# Altium project Grabber.PrjPCB (part 2 of 2)

## Sheet EEM_Connectors.SchDoc: =DocumentName
size A4; SPICEModelCacheVGBTAUBO: <root> / <DocumentId>VGBTAUBO</DocumentId> / </root>; DocumentNumber: 1; Revision: 0; SheetNumber: 6; SheetTotal: 10; Version: 2.0.0; Author 1: Grzegorz Kasprowicz; Author 2: Maciej Przybysz, Marta Fąfara; Author 3: Krzysztof Belewicz; Github: https://github.com/sinara-hw/Grabber; Last modified by: Krzysztof Belewicz
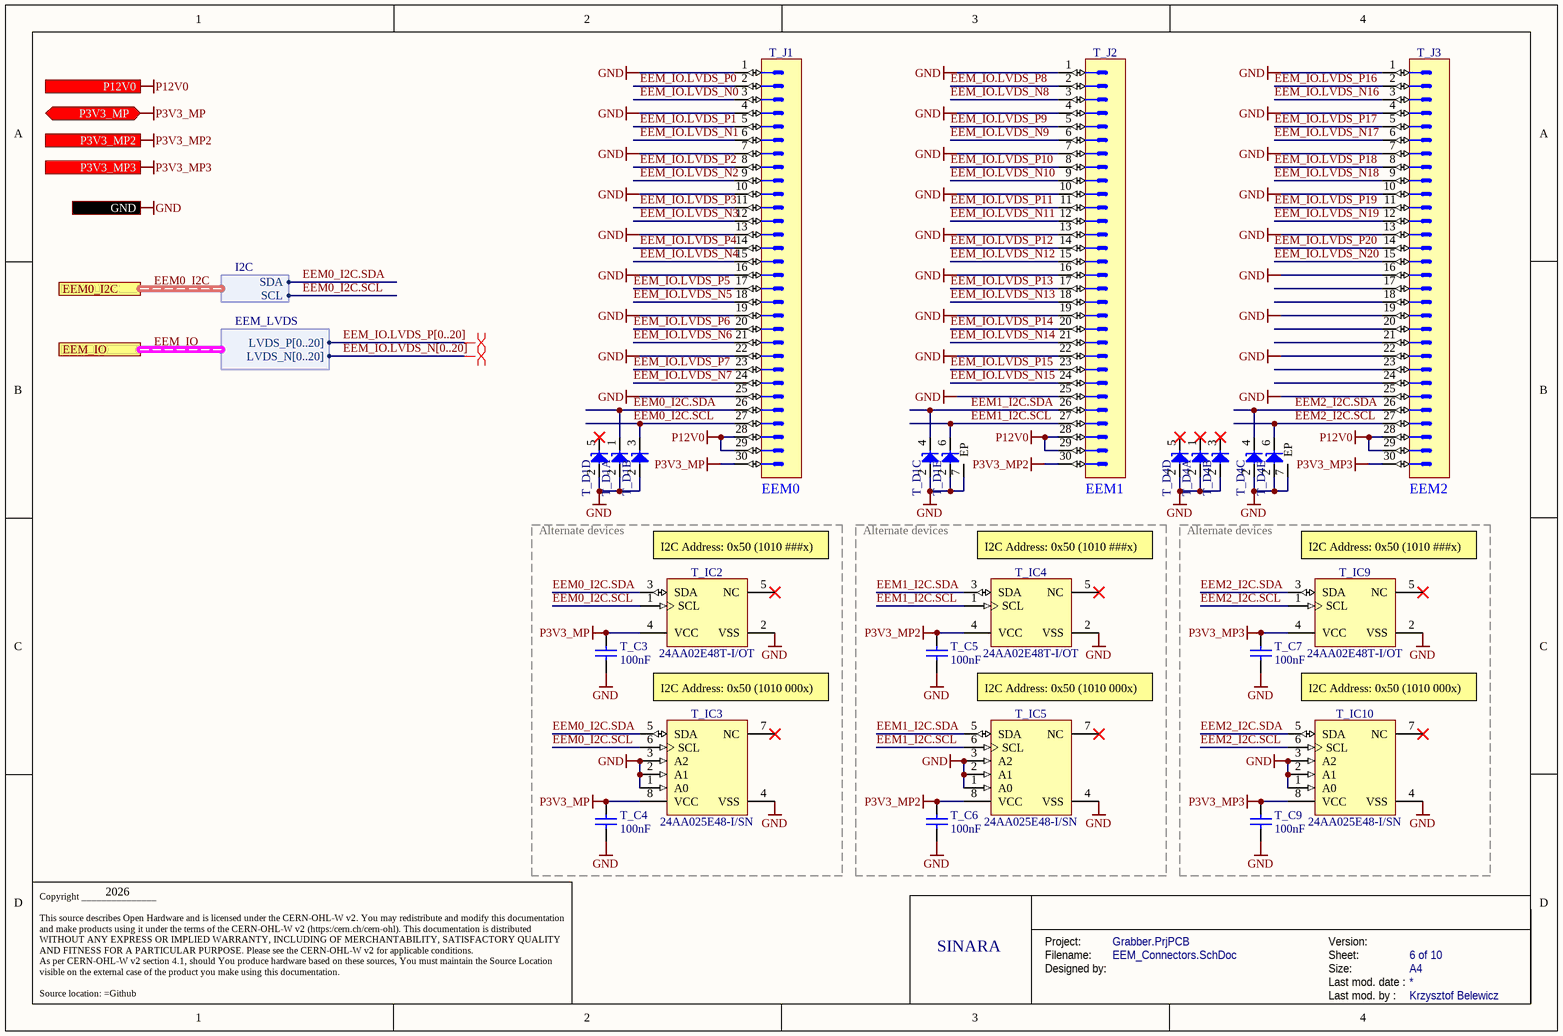
[diagram p4: EEM_Connectors.SchDoc]

### Parts
(Parts that share a designator on the sheet are numbered #1, #2 ... from top to bottom, then left to right.)
T_C3  100nF  [CAPC1005X55N]
T_C4  100nF  [CAPC1005X55N]
T_C5  100nF  [CAPC1005X55N]
T_C6  100nF  [CAPC1005X55N]
T_C7  100nF  [CAPC1005X55N]
T_C9  100nF  [CAPC1005X55N]
T_D1  UCLAMP3305P.TCT  [SON50P160X65_HS-7N]  (value not drawn)  (parts A,B,C,D,E of 5)
T_D4#2  UCLAMP3305P.TCT  [SON50P160X65_HS-7N]  (value not drawn)  (parts A,B,C,D,E of 5)
T_IC2  24AA02E48T-I/OT  [SOT95P280X145-5N]
T_IC3  24AA025E48-I/SN  [SOIC127P600X175-8N]
T_IC4  24AA02E48T-I/OT  [SOT95P280X145-5N]
T_IC5  24AA025E48-I/SN  [SOIC127P600X175-8N]
T_IC9  24AA02E48T-I/OT  [SOT95P280X145-5N]
T_IC10  24AA025E48-I/SN  [SOIC127P600X175-8N]
T_J1  (no value)  [3M_N2530-6002RB]
T_J2  (no value)  [3M_N2530-6002RB]
T_J3  (no value)  [3M_N2530-6002RB]

### Blocks framed on the sheet
Alternate devices: T_C3 T_C4 T_IC2 T_IC3
Alternate devices: T_C5 T_C6 T_IC4 T_IC5
Alternate devices: T_C7 T_C9 T_IC9 T_IC10

### Ports
EEM0_I2C (harness I2C), EEM_IO (harness EEM_LVDS), GND, P3V3_MP2 (out), P3V3_MP3 (out), P3V3_MP (bidir), P12V0 (out)

### Harnesses
EEM_LVDS: LVDS_P[0..20], LVDS_N[0..20]
I2C: SDA, SCL

### Nets
GND: T_C3.1 T_C4.1 T_C5.1 T_C6.1 T_C7.1 T_C9.1 T_D1.2(A) T_D1.7(EP) T_D4#2.2(A) T_D4#2.7(EP) T_IC2.2(VSS) T_IC3.1(A0) T_IC3.2(A1) T_IC3.3(A2) T_IC3.4(VSS) T_IC4.2(VSS) T_IC5.1(A0) T_IC5.2(A1) T_IC5.3(A2) T_IC5.4(VSS) T_IC9.2(VSS) T_IC10.1(A0) T_IC10.2(A1) T_IC10.3(A2) T_IC10.4(VSS) T_J1.1 T_J1.4 T_J1.7 T_J1.10 T_J1.13 T_J1.16 T_J1.19 T_J1.22 T_J1.25 T_J2.1 T_J2.4 T_J2.7 T_J2.10 T_J2.13 T_J2.16 T_J2.19 T_J2.22 T_J2.25 T_J3.1 T_J3.4 T_J3.7 T_J3.10 T_J3.13 T_J3.16 T_J3.19 T_J3.22 T_J3.25 ; port GND
P3V3_MP: T_C3.2 T_C4.2 T_IC2.4(VCC) T_IC3.8(VCC) T_J1.30 ; port P3V3_MP
P3V3_MP2: T_C5.2 T_C6.2 T_IC4.4(VCC) T_IC5.8(VCC) T_J2.30 ; port P3V3_MP2
P3V3_MP3: T_C7.2 T_C9.2 T_IC9.4(VCC) T_IC10.8(VCC) T_J3.30 ; port P3V3_MP3
P12V0: T_J1.28 T_J1.29 T_J2.28 T_J2.29 T_J3.28 T_J3.29 ; port P12V0
EEM0_I2C.SCL: T_D1.3(C) T_IC2.1(SCL) T_IC3.6(SCL) T_J1.27 ; port EEM0_I2C.SCL
EEM0_I2C.SDA: T_D1.1(C) T_IC2.3(SDA) T_IC3.5(SDA) T_J1.26 ; port EEM0_I2C.SDA
EEM1_I2C.SCL: T_D1.6(C) T_IC4.1(SCL) T_IC5.6(SCL) T_J2.27
EEM1_I2C.SDA: T_D1.4(C) T_IC4.3(SDA) T_IC5.5(SDA) T_J2.26
EEM2_I2C.SCL: T_D4#2.6(C) T_IC9.1(SCL) T_IC10.6(SCL) T_J3.27
EEM2_I2C.SDA: T_D4#2.4(C) T_IC9.3(SDA) T_IC10.5(SDA) T_J3.26
EEM_IO.LVDS_N0: T_J1.3
EEM_IO.LVDS_N1: T_J1.6
EEM_IO.LVDS_N2: T_J1.9
EEM_IO.LVDS_N3: T_J1.12
EEM_IO.LVDS_N4: T_J1.15
EEM_IO.LVDS_N5: T_J1.18
EEM_IO.LVDS_N6: T_J1.21
EEM_IO.LVDS_N7: T_J1.24
EEM_IO.LVDS_N8: T_J2.3
EEM_IO.LVDS_N9: T_J2.6
EEM_IO.LVDS_N10: T_J2.9
EEM_IO.LVDS_N11: T_J2.12
EEM_IO.LVDS_N12: T_J2.15
EEM_IO.LVDS_N13: T_J2.18
EEM_IO.LVDS_N14: T_J2.21
EEM_IO.LVDS_N15: T_J2.24
EEM_IO.LVDS_N16: T_J3.3
EEM_IO.LVDS_N17: T_J3.6
EEM_IO.LVDS_N18: T_J3.9
EEM_IO.LVDS_N19: T_J3.12
EEM_IO.LVDS_N20: T_J3.15
EEM_IO.LVDS_P0: T_J1.2
EEM_IO.LVDS_P1: T_J1.5
EEM_IO.LVDS_P2: T_J1.8
EEM_IO.LVDS_P3: T_J1.11
EEM_IO.LVDS_P4: T_J1.14
EEM_IO.LVDS_P5: T_J1.17
EEM_IO.LVDS_P6: T_J1.20
EEM_IO.LVDS_P7: T_J1.23
EEM_IO.LVDS_P8: T_J2.2
EEM_IO.LVDS_P9: T_J2.5
EEM_IO.LVDS_P10: T_J2.8
EEM_IO.LVDS_P11: T_J2.11
EEM_IO.LVDS_P12: T_J2.14
EEM_IO.LVDS_P13: T_J2.17
EEM_IO.LVDS_P14: T_J2.20
EEM_IO.LVDS_P15: T_J2.23
EEM_IO.LVDS_P16: T_J3.2
EEM_IO.LVDS_P17: T_J3.5
EEM_IO.LVDS_P18: T_J3.8
EEM_IO.LVDS_P19: T_J3.11
EEM_IO.LVDS_P20: T_J3.14

Not connected (* = marked no-connect by the designer): T_D1 5(C)*; T_D4#2 1(C)* 3(C)* 5(C)*; T_IC2 5(NC)*; T_IC3 7(NC)*; T_IC4 5(NC)*; T_IC5 7(NC)*; T_IC9 5(NC)*; T_IC10 7(NC)*; T_J3 17 18 20 21 23 24

### Buses and harness runs
bus EEM_IO.LVDS_N[0..20]
bus EEM_IO.LVDS_P[0..20]
harness EEM0_I2C = port EEM0_I2C
harness EEM_IO = port EEM_IO

### Layout directives
differential pair; differential pair class Diff_100Ohm: (no net found under the mark)

### Notes on the sheet
- (near T_J1) EEM0
- (near T_J2) EEM1
- (near T_J3) EEM2
- (near T_IC2) I2C Address: 0x50 (1010 ###x)
- (near T_IC4) I2C Address: 0x50 (1010 ###x)
- (near T_IC9) I2C Address: 0x50 (1010 ###x)
- I2C Address: 0x50 (1010 000x)
- 2026
- SINARA
- Project:
- Designed by:
- Filename:
- Size:
- Version:
- Last mod. date :
- Sheet:
- A4
- Copyright _______________
  This source describes Open Hardware and is licensed under the CERN-OHL-W v2. You may redistribute and modify this documentation and make products using it under the terms of the CERN-OHL-W v2 (https:/cern.ch/cern-ohl). This documentation is distributed WITHOUT ANY EXPRESS OR IMPLIED WARRANTY, INCLUDING OF MERCHANTABILITY, SATISFACTORY QUALITY AND FITNESS FOR A PARTICULAR PURPOSE. Please see the CERN-OHL-W v2 for applicable conditions.
  As per CERN-OHL-W v2 section 4.1, should You produce hardware based on these sources, You must maintain the Source Location visible on the external case of the product you make using this documentation.
  Source location: =Github
- Last mod. by :

### Library data of the parts
T_C3-T_C7 T_C9 = CC0402_100NF_50V_10%_X7R: as C59 on sheet Power_Supplies; Part Number: CC0402_100NF_50V_10%_X7R; Component Kind: Standard; Component Type: Standard; Pin Count: 2; Value: 100nF; Status: None; Manufacturer Part Number: CC0402_100NF_50V_10%_X7R; Case: 0402; Mounted: Yes; Socket: No; SMD: Yes; Sense: No; HelpURL: \\cern.ch\dfs\Applications\Altium\Datasheets\CC0402_MURATA_GRM155R71H104KE14D.pdf; Author: CERN DEM MR; CreateDate: 30.06.2017; LatestRevisionDate: 30.06.2017; Manufacturer1 Example: MURATA; Manufacturer1 ComponentHeight: 0.55mm
T_D1 T_D4#2 = CMP-004-00037-2: Diode TVS Quint Common Anode Uni-Dir 3.3V 40W 6-Pin SLP EP T/R; Max Operating Temperature: 125°C; Min Operating Temperature: -55°C; Pins: 6; Mounting Technology: Surface Mount
T_IC2 T_IC4 T_IC9 = 24AA02E48T-I/OT: 1.7V-5.5V, 2K I2C Serial EEPROM With EUI-48 Node Identity; Manufacturer: MICROCHIP TECHNOLOGY; PressFit: No; Bonding: No; Part Number: 24AA02E48T-I/OT; Component Kind: Standard; Component Type: Standard; Device: 24AA02E48T-I/OT; PackageDescription: SOT, 0.95mm pitch; 5 pin, 1.60mm W X 2.90mm L X 1.45mm H body, IPC Medium Density; Part Description: 1.7V-5.5V, 2K I2C Serial EEPROM with EUI-48 Node Identity; Manufacturer Part Number: 24AA02E48T-I/OT; Pin Count: 5; Case: SOT23-5; Mounted: Yes; Socket: No; SMD: Yes; Sense: No; ComponentHeight: 1.45mm; HelpURL: \\cern.ch\dfs\Applications\Altium\Datasheets\24AA02E48T-I-OT.pdf; Author: CERN DEM MR; CreateDate: 31.03.2016; LatestRevisionDate: 31.03.2016
T_IC3 T_IC5 T_IC10 = 24AA025E48-I/SN: 1.7V-5.5V, 2K I2C™ Serial EEPROMs with EUI-48™ Node Identity; Manufacturer: MICROCHIP TECHNOLOGY; PressFit: No; Bonding: No; Part Number: 24AA025E48-I/SN; Component Kind: Standard; Component Type: Standard; Device: 24AA025E48-I/SN; PackageDescription: SOIC 8, Pitch 1.27mm - Body 4x5mm, IPC Medium Density; Part Description: 1.7V-5.5V, 2K I2C™ Serial EEPROMs with EUI-48™ Node Identity; Manufacturer Part Number: 24AA025E48-I/SN; Pin Count: 8; Case: SOIC8; Mounted: Yes; Socket: No; SMD: Yes; Sense: No; ComponentHeight: 1.75mm; HelpURL: \\cern.ch\dfs\Applications\Altium\Datasheets\24AA025E48-I-SN.pdf; Author: CERN DEM MR; CreateDate: 19.07.2016; LatestRevisionDate: 19.07.2016
T_J1-T_J3 = 3M_N2530-6002RB: Connector 30 Male; Part Description: 30 Contacts - Straight .100'' x .100'' Low Profile Four-Wall Header, 2500 Series; Manufacturer: 3M; PressFit: No; Part Number: 3M_N2530-6002RB; Component Kind: Standard; Component Type: Standard; Pin Count: 30; Family: Header 30; Mounted: Yes; Socket: No; SMD: No; Sense: No; Status: None; Manufacturer Part Number: N2530-6002RB; ComponentHeight: 10.03mm; HelpURL: \\cern.ch\dfs\Applications\Altium\Datasheets\3M_N2530-6002RB.pdf; Author: CERN DEM JLC; CreateDate: 11.02.2009; LatestRevisionDate: 11.08.2009

## Sheet Temperature_monitoring.SchDoc: =DocumentName
size A4; DocumentNumber: 1; Revision: 0; SheetNumber: 9; SheetTotal: 10; Version: 2.0.0; Author 1: Grzegorz Kasprowicz; Author 2: Maciej Przybysz, Marta Fąfara; Author 3: Krzysztof Belewicz; Github: https://github.com/sinara-hw/Grabber; Last modified by: Krzysztof Belewicz
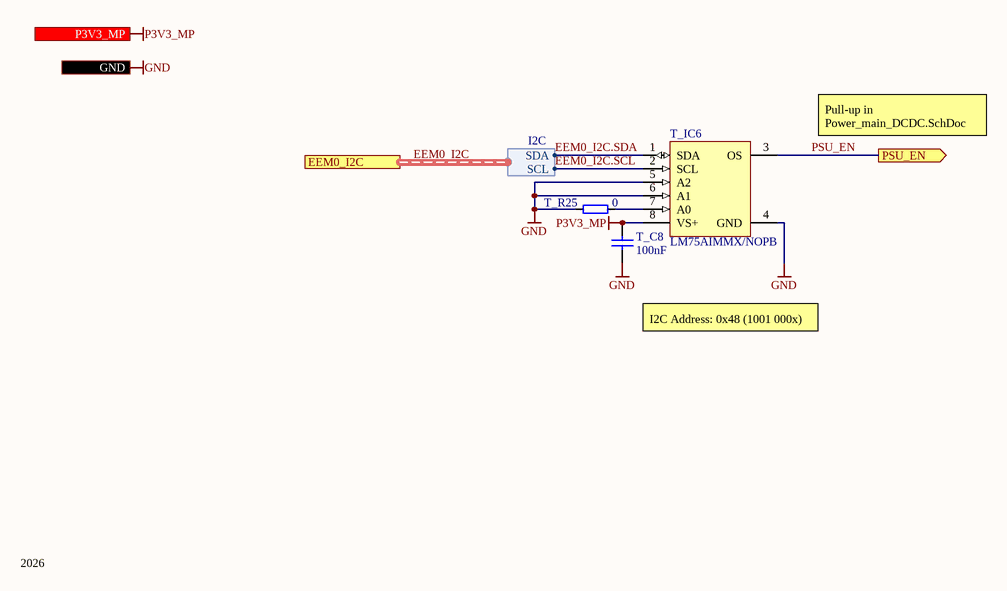
[diagram p5: Temperature_monitoring.SchDoc]

### Parts
T_C8  100nF  [CAPC1005X55N]
T_IC6  LM75AIMMX/NOPB  [DGK0008A_M]
T_R25  0  [RESC1005X40N]

### Ports
EEM0_I2C (harness I2C), GND, P3V3_MP (in), PSU_EN (out)

### Harnesses
I2C: SDA, SCL

### Nets
GND: T_C8.1 T_IC6.4(GND) T_IC6.5(A2) T_IC6.6(A1) T_R25.1 ; port GND
P3V3_MP: T_C8.2 T_IC6.8(VS+) ; port P3V3_MP
EEM0_I2C.SCL: T_IC6.2(SCL) ; port EEM0_I2C.SCL
EEM0_I2C.SDA: T_IC6.1(SDA) ; port EEM0_I2C.SDA
PSU_EN: T_IC6.3(OS) ; port PSU_EN
NetT_IC6_7: T_IC6.7(A0) T_R25.2

### Buses and harness runs
harness EEM0_I2C = port EEM0_I2C

### Notes on the sheet
- Pull-up in Power_main_DCDC.SchDoc
- I2C Address: 0x48 (1001 000x)
- 2026
- SINARA
- Project:
- Designed by:
- Filename:
- Size:
- Version:
- Last mod. date :
- Sheet:
- A4
- Copyright _______________
  This source describes Open Hardware and is licensed under the CERN-OHL-W v2. You may redistribute and modify this documentation and make products using it under the terms of the CERN-OHL-W v2 (https:/cern.ch/cern-ohl). This documentation is distributed WITHOUT ANY EXPRESS OR IMPLIED WARRANTY, INCLUDING OF MERCHANTABILITY, SATISFACTORY QUALITY AND FITNESS FOR A PARTICULAR PURPOSE. Please see the CERN-OHL-W v2 for applicable conditions.
  As per CERN-OHL-W v2 section 4.1, should You produce hardware based on these sources, You must maintain the Source Location visible on the external case of the product you make using this documentation.
  Source location: =Github
- Last mod. by :

### Library data of the parts
T_C8 = CC0402_100NF_50V_10%_X7R: as C59 on sheet Power_Supplies; Part Number: CC0402_100NF_50V_10%_X7R; Component Kind: Standard; Component Type: Standard; Pin Count: 2; Value: 100nF; Status: None; Manufacturer Part Number: CC0402_100NF_50V_10%_X7R; Case: 0402; Mounted: Yes; Socket: No; SMD: Yes; Sense: No; Manufacturer1 Example: MURATA; Manufacturer1 ComponentHeight: 0.55mm; HelpURL: \\cern.ch\dfs\Applications\Altium\Datasheets\CC0402_MURATA_GRM155R71H104KE14D.pdf; Author: CERN DEM MR; CreateDate: 30.06.2017; LatestRevisionDate: 30.06.2017
T_IC6 = CMP-010-00652-2: Serial Switch/Digital Sensor, 9 Bit(s), 3Cel, Square, 8 Pin, Surface Mount; Min Supply Voltage: 2.7V; Max Supply Voltage: 5.5V; Sensor Type: TEMPERATURE SENSOR,SWITCH/DIGITAL OUTPUT,SERIAL; Max Operating Temperature: 125°C; Min Operating Temperature: -55°C; Pins: 8; RoHS Compliant: Yes; Mounting Technology: Surface Mount
T_R25 = R0402_0R_JUMPER: Resistor; Part Description: 1A (0.05R Max DC Resistance) Zero Ohm Jumper; Manufacturer: GENERIC; Manufacturer1 Part Number: 232270591001L; Part Number: R0402_0R_JUMPER; Component Kind: Standard; Component Type: Standard; Pin Count: 2; Value: 0; Status: Not recommended; Manufacturer Part Number: R0402_0R_JUMPER; Case: 0402; Mounted: Yes; Sense: No; Socket: No; SMD: Yes; Manufacturer1 Example: YAGEO PHYCOMP; Manufacturer1 ComponentHeight: 0.4mm; HelpURL: \\cern.ch\dfs\Applications\Altium\Datasheets\R0402_Phycomp_RC0402.pdf; Author: CERN DEM JLC; CreateDate: 03.12.2007; LatestRevisionDate: 17.10.2012

## Sheet Mechanical.SchDoc: =DocumentName
size A4; DocumentNumber: 1; Revision: 0; SheetNumber: 10; SheetTotal: 10; Version: 2.0.0; Author 1: Grzegorz Kasprowicz; Author 2: Maciej Przybysz, Marta Fąfara; Author 3: Krzysztof Belewicz; Github: https://github.com/sinara-hw/Grabber; Last modified by: Krzysztof Belewicz
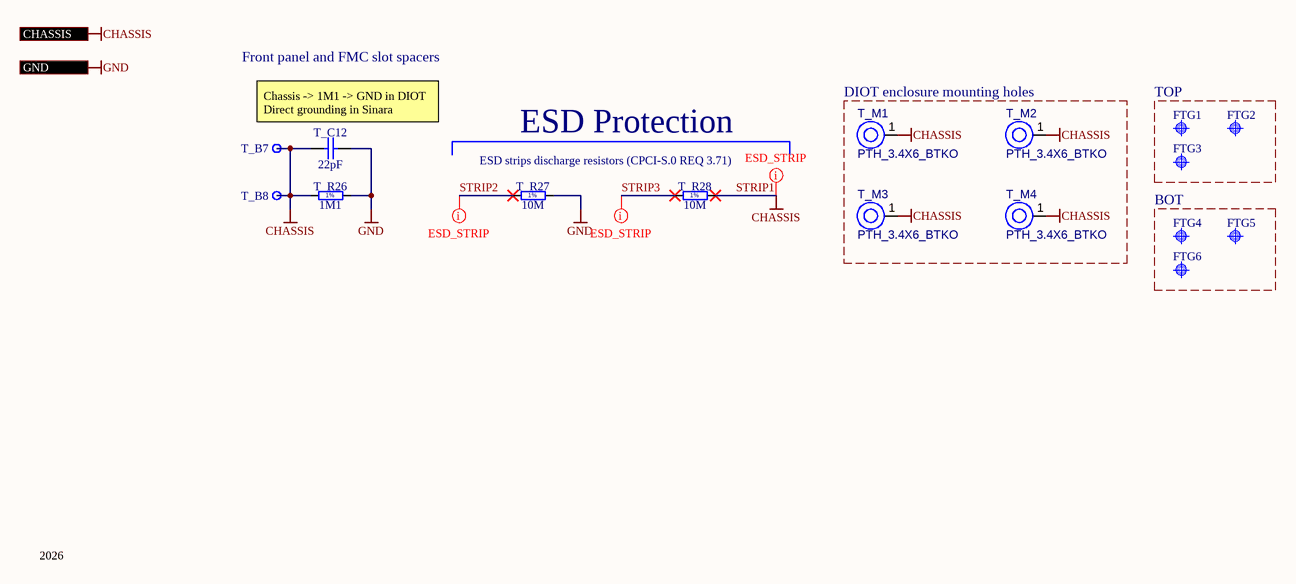
[diagram p6: Mechanical.SchDoc]

### Parts
FTG1  Use only in PCB  [FIDUCIAL_TOP_C100-200]  (value not drawn)  (no BOM)
FTG2  Use only in PCB  [FIDUCIAL_TOP_S100-200]  (value not drawn)  (no BOM)
FTG3  Use only in PCB  [FIDUCIAL_TOP_S100-200]  (value not drawn)  (no BOM)
FTG4  Use only in PCB  [FIDUCIAL_TOP_C100-200]  (value not drawn)  (no BOM)
FTG5  Use only in PCB  [FIDUCIAL_TOP_S100-200]  (value not drawn)  (no BOM)
FTG6  Use only in PCB  [FIDUCIAL_TOP_S100-200]  (value not drawn)  (no BOM)
T_B7  Plated Hole  [c600h270]  (value not drawn)  (no BOM)
T_B8  Plated Hole  [c600h270]  (value not drawn)  (no BOM)
T_C12  22pF  [CAPC1005X55N]
T_M1  PTH_3.4X6_BTKO  [PTH-M3.4x6.0_BTKO]  (no BOM)
T_M2  PTH_3.4X6_BTKO  [PTH-M3.4x6.0_BTKO]  (no BOM)
T_M3  PTH_3.4X6_BTKO  [PTH-M3.4x6.0_BTKO]  (no BOM)
T_M4  PTH_3.4X6_BTKO  [PTH-M3.4x6.0_BTKO]  (no BOM)
T_R26  1M1  [RESC2012X60N]
T_R27  10M  [RESC2113X55N]
T_R28  10M  [RESC2113X55N]

### Blocks framed on the sheet
DIOT enclosure mounting holes: T_M1-T_M4
TOP: FTG1-FTG3
BOT: FTG4-FTG6

### Ports
CHASSIS, GND

### Nets
GND: T_C12.2 T_R26.2 T_R27.2 ; port GND
STRIP1: T_B7.1 T_B8.1 T_C12.1 T_M1.1(H1) T_M2.1(H1) T_M3.1(H1) T_M4.1(H1) T_R26.1 T_R28.2 ; port CHASSIS  [also labelled CHASSIS]
STRIP2: T_R27.1
STRIP3: T_R28.1

### Layout directives
net class ESD_STRIP: STRIP1, STRIP2, STRIP3

### Notes on the sheet
- Front panel and FMC slot spacers
- Chassis -> 1M1 -> GND in DIOT
  Direct grounding in Sinara
- ESD strips discharge resistors (CPCI-S.0 REQ 3.71)
- ESD Protection
- 2026
- SINARA
- Project:
- Designed by:
- Filename:
- Size:
- Version:
- Last mod. date :
- Sheet:
- A4
- Copyright _______________
  This source describes Open Hardware and is licensed under the CERN-OHL-W v2. You may redistribute and modify this documentation and make products using it under the terms of the CERN-OHL-W v2 (https:/cern.ch/cern-ohl). This documentation is distributed WITHOUT ANY EXPRESS OR IMPLIED WARRANTY, INCLUDING OF MERCHANTABILITY, SATISFACTORY QUALITY AND FITNESS FOR A PARTICULAR PURPOSE. Please see the CERN-OHL-W v2 for applicable conditions.
  As per CERN-OHL-W v2 section 4.1, should You produce hardware based on these sources, You must maintain the Source Location visible on the external case of the product you make using this documentation.
  Source location: =Github
- Last mod. by :
- (in symbol R0805_1M1_1%_0.125W_100PPM) 1%
- (in symbol R0805_10M_1%_0.125W_100PPM_VISHAY_CRCW e3) 1%

### Library data of the parts
FTG1 FTG4 = FIDUCIAL_TARGET_C100-200: Fiducial Target; Part Description: Round Fiducial Target, Top Layer, 1.0mm, Top Solder 2.0mm, Keepout =2.0mm; Mounted: No; Part Number: FIDUCIAL_TARGET_C100-200; Component Type: Standard (No BOM); Pin Count: 1; Family: Fiducial; Socket: No; SMD: Yes; Sense: No; Status: None; ComponentHeight: 0mm; HelpURL: Undefined; Author: CERN DEM JLC; CreateDate: 09.02.2010; LatestRevisionDate: 04.04.2012; PackageDescription: Round Fiducial Target, Top Layer, 1.0mm, Top Solder 2.0mm, Keepout =2.0mm
FTG2 FTG3 FTG5 FTG6 = FIDUCIAL_TARGET_S100-200: Fiducial Target; Part Description: Square Fiducial Target, Top Layer, 1.0mm, Top Solder 2.0mm, Keepout =2.0mm; Mounted: No; Part Number: FIDUCIAL_TARGET_S100-200; Component Type: Standard (No BOM); Pin Count: 1; Family: Fiducial; Socket: No; SMD: Yes; Sense: No; Status: None; ComponentHeight: 0mm; HelpURL: Undefined; Author: CERN DEM JLC; CreateDate: 09.02.2010; LatestRevisionDate: 04.04.2012; PackageDescription: Square Fiducial Target, Top Layer, 1.0mm, Top Solder 2.0mm, Keepout =2.0mm
T_B7 T_B8 = PLATED_HOLE2.7_PAD6.0: Single Terminal Socket; Part Description: Plated Through Hole: Hole Dia.=2.7mm Pad Dia.=6.0mm; Mounted: No; Part Number: PLATED_HOLE2.7_PAD6.0; Component Type: Standard (No BOM); Pin Count: 1; Family: Plated Hole; Socket: No; SMD: No; Sense: No; Status: None; ComponentHeight: 0mm; HelpURL: Undefined; Author: CERN DEM HF; CreateDate: 28.08.2024; LatestRevisionDate: 28.08.2024; PackageDescription: Plated Through Hole: Hole Dia.=2.7mm Pad Dia.=6.0mm
T_C12 = CC0402_22PF_50V_5%_C0G: Non-polarised capacitor; Part Description: SMD Multilayer Chip Ceramic Capacitor; Manufacturer: GENERIC; Manufacturer1 Part Number: C0402C220J5GACTU; Voltage: 50V; TC: C0G/NP0; Tolerance: ±5%; Part Number: CC0402_22PF_50V_5%_C0G; Component Kind: Standard; Component Type: Standard; Pin Count: 2; Value: 22pF; Status: Preferred; Manufacturer Part Number: CC0402_22PF_50V_5%_C0G; Case: 0402; Mounted: Yes; Socket: No; SMD: Yes; Manufacturer1 Example: KEMET; Manufacturer1 ComponentHeight: 0.55mm; HelpURL: \\cern.ch\dfs\Applications\Altium\Datasheets\CC0402_C0G_KEMET_(Commercial Grade).pdf; Author: CERN DEM JLC; CreateDate: 2007-12-03; LatestRevisionDate: 2007-12-03; Sense: No
T_M1-T_M4 = CMP-00028-00019-2: PTH  Hole 3.4, 6mm pad; Pins: 1
T_R26 = R0805_1M1_1%_0.125W_100PPM: Resistor - 1%; Part Description: General Purpose Thick Film Chip Resistor; Manufacturer: GENERIC; Manufacturer1 Part Number: NRC10F1104TRF; PressFit: No; Part Number: R0805_1M1_1%_0.125W_100PPM; Component Kind: Standard; Component Type: Standard; Pin Count: 2; Value: 1M1; Status: Preferred; Manufacturer Part Number: R0805_1M1_1%_0.125W_100PPM; Case: 0805; Mounted: Yes; Sense: No; Socket: No; SMD: Yes; Manufacturer1 Example: NIC COMPONENT; Manufacturer1 ComponentHeight: 0.6mm; HelpURL: \\cern.ch\dfs\Applications\Altium\Datasheets\R0805_NIC_NRC.pdf; Author: CERN DEM JLC; CreateDate: 03/12/2007; LatestRevisionDate: 13/03/2008
T_R27 T_R28 = R0805_10M_1%_0.125W_100PPM_VISHAY_CRCW e3: Resistor - 1%; Part Description: 150V, Standard Thick Film Chip Resistor; Manufacturer: VISHAY DALE; Manufacturer Part Number: CRCW080510M0FKEA; Power: 0.125W; TC: ±100ppm/°C; PressFit: No; Part Number: R0805_10M_1%_0.125W_100PPM_VISHAY_CRCW e3; Component Kind: Standard; Component Type: Standard; Pin Count: 2; Value: 10M; Status: None; Tolerance: ±1%; Case: 0805; Mounted: Yes; Sense: No; Socket: No; SMD: Yes; ComponentHeight: 0.5mm; HelpURL: \\cern.ch\dfs\Applications\Altium\Datasheets\R0805_VISHAY_CRCW e3.pdf; Author: CERN DEM BC; CreateDate: 2019-11-12; LatestRevisionDate: 2019-11-12

## Sheet FP_Connectors.SchDoc: =DocumentName
size A4; DocumentNumber: 1; Revision: 0; SheetNumber: 5; SheetTotal: 10; Version: 2.0.0; Author 1: Grzegorz Kasprowicz; Author 2: Maciej Przybysz, Marta Fąfara; Author 3: Krzysztof Belewicz; Github: https://github.com/sinara-hw/Grabber; Last modified by: Krzysztof Belewicz
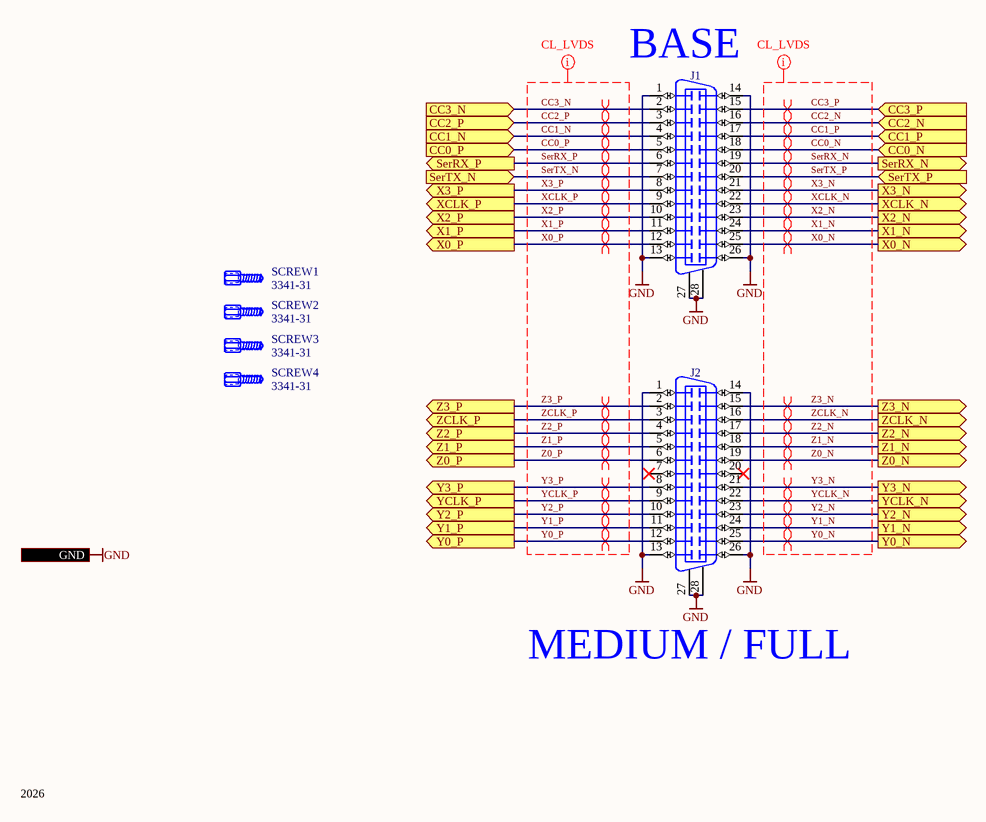
[diagram p7: FP_Connectors.SchDoc]

### Parts
J1  N10226-5212PC  [3M_N10226-5212PC]  (value not drawn)
J2  N10226-5212PC  [3M_N10226-5212PC]  (value not drawn)
SCREW1  3341-31  [3M_3341-31]
SCREW2  3341-31  [3M_3341-31]
SCREW3  3341-31  [3M_3341-31]
SCREW4  3341-31  [3M_3341-31]

### Ports
CC0_N (in), CC0_P (in), CC1_N (in), CC1_P (in), CC2_N (in), CC2_P (in), CC3_N (in), CC3_P (in), GND, SerRX_N (out), SerRX_P (out), SerTX_N (in), SerTX_P (in), X0_N (out), X0_P (out), X1_N (out), X1_P (out), X2_N (out), X2_P (out), X3_N (out), X3_P (out), XCLK_N (out), XCLK_P (out), Y0_N (out), Y0_P (out), Y1_N (out), Y1_P (out), Y2_N (out), Y2_P (out), Y3_N (out), Y3_P (out), YCLK_N (out), YCLK_P (out), Z0_N (out), Z0_P (out), Z1_N (out), Z1_P (out), Z2_N (out), Z2_P (out), Z3_N (out), Z3_P (out), ZCLK_N (out), ZCLK_P (out)

### Nets
GND: J1.1 J1.13 J1.14 J1.26 J1.27 J1.28 J2.1 J2.13 J2.14 J2.26 J2.27 J2.28 ; port GND
CC0_N: J1.18 ; port CC0_N
CC0_P: J1.5 ; port CC0_P
CC1_N: J1.4 ; port CC1_N
CC1_P: J1.17 ; port CC1_P
CC2_N: J1.16 ; port CC2_N
CC2_P: J1.3 ; port CC2_P
CC3_N: J1.2 ; port CC3_N
CC3_P: J1.15 ; port CC3_P
SerRX_N: J1.19 ; port SerRX_N
SerRX_P: J1.6 ; port SerRX_P
SerTX_N: J1.7 ; port SerTX_N
SerTX_P: J1.20 ; port SerTX_P
X0_N: J1.25 ; port X0_N
X0_P: J1.12 ; port X0_P
X1_N: J1.24 ; port X1_N
X1_P: J1.11 ; port X1_P
X2_N: J1.23 ; port X2_N
X2_P: J1.10 ; port X2_P
X3_N: J1.21 ; port X3_N
X3_P: J1.8 ; port X3_P
XCLK_N: J1.22 ; port XCLK_N
XCLK_P: J1.9 ; port XCLK_P
Y0_N: J2.25 ; port Y0_N
Y0_P: J2.12 ; port Y0_P
Y1_N: J2.24 ; port Y1_N
Y1_P: J2.11 ; port Y1_P
Y2_N: J2.23 ; port Y2_N
Y2_P: J2.10 ; port Y2_P
Y3_N: J2.21 ; port Y3_N
Y3_P: J2.8 ; port Y3_P
YCLK_N: J2.22 ; port YCLK_N
YCLK_P: J2.9 ; port YCLK_P
Z0_N: J2.19 ; port Z0_N
Z0_P: J2.6 ; port Z0_P
Z1_N: J2.18 ; port Z1_N
Z1_P: J2.5 ; port Z1_P
Z2_N: J2.17 ; port Z2_N
Z2_P: J2.4 ; port Z2_P
Z3_N: J2.15 ; port Z3_N
Z3_P: J2.2 ; port Z3_P
ZCLK_N: J2.16 ; port ZCLK_N
ZCLK_P: J2.3 ; port ZCLK_P

Not connected (* = marked no-connect by the designer): J2 7* 20*

### Layout directives
differential pair: CC0_N, CC0_P, CC1_N, CC1_P, CC2_N, CC2_P, CC3_N, CC3_P, SerRX_N, SerRX_P, SerTX_N, SerTX_P, X0_N, X0_P, X1_N, X1_P, X2_N, X2_P, X3_N, X3_P, XCLK_N, XCLK_P, Y0_N, Y0_P, Y1_N, Y1_P, Y2_N, Y2_P, Y3_N, Y3_P, YCLK_N, YCLK_P, Z0_N, Z0_P, Z1_N, Z1_P, Z2_N, Z2_P, Z3_N, Z3_P, ZCLK_N, ZCLK_P
net class CL_LVDS: CC0_N, CC0_P, CC1_N, CC1_P, CC2_N, CC2_P, CC3_N, CC3_P, SerRX_N, SerRX_P, SerTX_N, SerTX_P, X0_N, X0_P, X1_N, X1_P, X2_N, X2_P, X3_N, X3_P, XCLK_N, XCLK_P, Y0_N, Y0_P, Y1_N, Y1_P, Y2_N, Y2_P, Y3_N, Y3_P, YCLK_N, YCLK_P, Z0_N, Z0_P, Z1_N, Z1_P, Z2_N, Z2_P, Z3_N, Z3_P, ZCLK_N, ZCLK_P

### Notes on the sheet
- (near J1) BASE
- (near J2) MEDIUM / FULL
- 2026
- SINARA
- Project:
- Designed by:
- Filename:
- Size:
- Version:
- Last mod. date :
- Sheet:
- A4
- Copyright _______________
  This source describes Open Hardware and is licensed under the CERN-OHL-W v2. You may redistribute and modify this documentation and make products using it under the terms of the CERN-OHL-W v2 (https:/cern.ch/cern-ohl). This documentation is distributed WITHOUT ANY EXPRESS OR IMPLIED WARRANTY, INCLUDING OF MERCHANTABILITY, SATISFACTORY QUALITY AND FITNESS FOR A PARTICULAR PURPOSE. Please see the CERN-OHL-W v2 for applicable conditions.
  As per CERN-OHL-W v2 section 4.1, should You produce hardware based on these sources, You must maintain the Source Location visible on the external case of the product you make using this documentation.
  Source location: =Github
- Last mod. by :

### Library data of the parts
J1 J2 = 3M_N10226-5212PC: Connector Mini D Ribbon (MDR) 26 Female; Part Description: 26 contacts, Mini D Ribbon (MDR), .050" Boardmount Through-hole Right Angle Receptacle-Shielded, Diecast Body, 102 Series; Manufacturer: 3M; PressFit: No; Part Number: N10226-5212PC; Component Kind: Standard; Component Type: Standard; Footprint: MDR 26; Pin Count: 28; Family: MDR 26; Mounted: Yes; Socket: No; SMD: No; Sense: No; Status: None; Manufacturer Part Number: N10226-5212PC; ComponentHeight: 9.4mm; HelpURL: \\cern.ch\dfs\Applications\Altium\Datasheets\3M_N10226-5212PC.pdf; Author: CERN DEM JLC; CreateDate: 18.11.2008; LatestRevisionDate: 14.10.2009
SCREW1-SCREW4 = MECH_MDR_screw_lock: VHDCI Female Screw Lock; Part Description: MDR Female Screw Locks, Thread Size: M2.5; Manufacturer: 3M; PressFit: No; Part Number: 3341-31; Component Kind: Standard; Component Type: Mechanical; Pin Count: 0; PackageDescription: MDR Female Screw Locks, Thread Size: M2.5; Mounted: Yes; Socket: No; SMD: No; Sense: No; Status: None; Value: 3341-31; Manufacturer Part Number: 3341-31; ComponentHeight: 5.48mm; HelpURL: \\cern.ch\dfs\Applications\Altium\Datasheets\TYCO_749087-2.pdf; Author: GK; CreateDate: 10.09.2013; LatestRevisionDate: 10.09.2013

## Sheet LVDS_repeater.SchDoc: =DocumentName
size A4; DocumentNumber: 1; Revision: 0; SheetNumber: 2; SheetTotal: 10; Version: 2.0.0; Author 1: Grzegorz Kasprowicz; Author 2: Maciej Przybysz, Marta Fąfara; Author 3: Krzysztof Belewicz; Github: https://github.com/sinara-hw/Grabber; Last modified by: Krzysztof Belewicz
Used 21 times, as channels U_LVDS_repeater0, U_LVDS_repeater2, U_LVDS_repeater4, U_LVDS_repeater6, U_LVDS_repeater8, U_LVDS_repeater10, U_LVDS_repeater12, U_LVDS_repeater14, U_LVDS_repeater16, U_LVDS_repeater18, U_LVDS_repeater1, U_LVDS_repeater3, U_LVDS_repeater5, U_LVDS_repeater7, U_LVDS_repeater9, U_LVDS_repeater11, U_LVDS_repeater13, U_LVDS_repeater15, U_LVDS_repeater17, U_LVDS_repeater19, U_LVDS_repeater20. Parts and nets are listed once, with the designators drawn on the sheet.
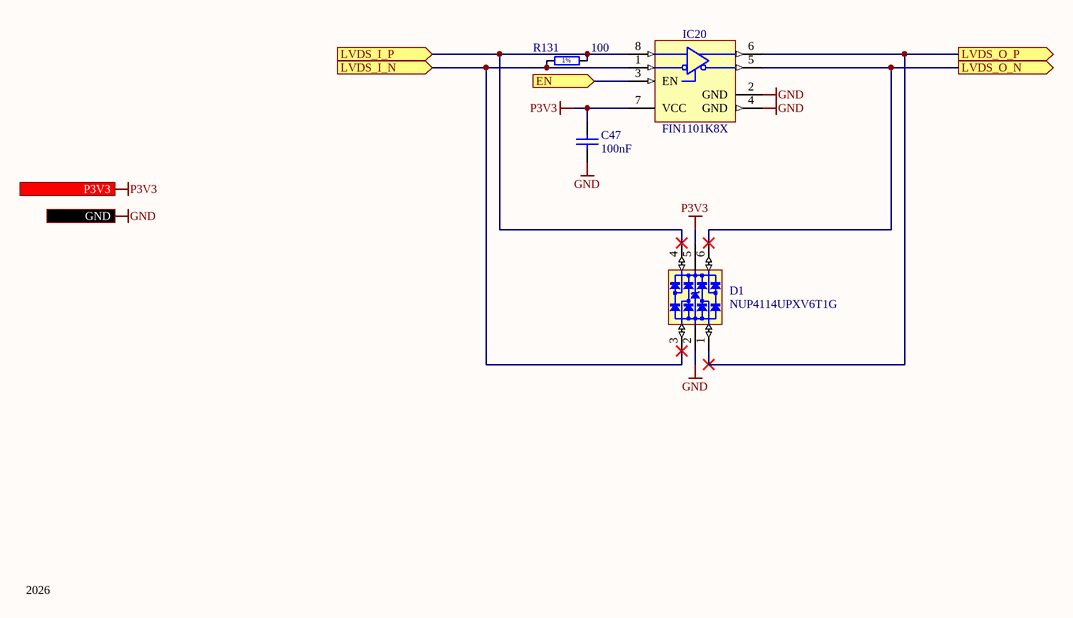
[diagram p8: LVDS_repeater.SchDoc]

### Parts
C47  100nF  [CAPC1005X55N]
D1  NUP4114UPXV6T1G  [SOTFL50P160X60-6N]
IC20  FIN1101K8X  [SOP50P310X90-8N]
R131  100  [RESC1005X40N]

### Ports
EN (in), GND, LVDS_I_N (in), LVDS_I_P (in), LVDS_O_N (out), LVDS_O_P (out), P3V3 (in)

### Nets
GND: C47.1 D1.2(GND) IC20.2(GND) IC20.4(GND) ; port GND
P3V3: C47.2 D1.5(VBUS) IC20.7(VCC) ; port P3V3
EN: IC20.3(EN) ; port EN
LVDS_I_N: D1.3(I/O2) IC20.1(RIN-) R131.1 ; port LVDS_I_N
LVDS_I_P: D1.4(I/O3) IC20.8(RIN+) R131.2 ; port LVDS_I_P
LVDS_O_N: D1.6(I/O4) IC20.5(DOUT-) ; port LVDS_O_N
LVDS_O_P: D1.1(I/O1) IC20.6(DOUT+) ; port LVDS_O_P

### Channels
U_LVDS_repeater0: designators end in A; ports EN=RX_EN GND=GND LVDS_I_N=XCLK_N LVDS_I_P=XCLK_P LVDS_O_N=EEM_IO.LVDS_N0 LVDS_O_P=EEM_IO.LVDS_P0 P3V3=P3V3
U_LVDS_repeater2: designators end in C; ports EN=RX_EN GND=GND LVDS_I_N=X0_N LVDS_I_P=X0_P LVDS_O_N=EEM_IO.LVDS_N1 LVDS_O_P=EEM_IO.LVDS_P1 P3V3=P3V3
U_LVDS_repeater4: designators end in E; ports EN=RX_EN GND=GND LVDS_I_N=X1_N LVDS_I_P=X1_P LVDS_O_N=EEM_IO.LVDS_N2 LVDS_O_P=EEM_IO.LVDS_P2 P3V3=P3V3
U_LVDS_repeater6: designators end in G; ports EN=RX_EN GND=GND LVDS_I_N=X2_N LVDS_I_P=X2_P LVDS_O_N=EEM_IO.LVDS_N3 LVDS_O_P=EEM_IO.LVDS_P3 P3V3=P3V3
U_LVDS_repeater8: designators end in I; ports EN=RX_EN GND=GND LVDS_I_N=X3_N LVDS_I_P=X3_P LVDS_O_N=EEM_IO.LVDS_N4 LVDS_O_P=EEM_IO.LVDS_P4 P3V3=P3V3
U_LVDS_repeater10: designators end in K; ports EN=RX_EN GND=GND LVDS_I_N=YCLK_N LVDS_I_P=YCLK_P LVDS_O_N=EEM_IO.LVDS_N8 LVDS_O_P=EEM_IO.LVDS_P8 P3V3=P3V3
U_LVDS_repeater12: designators end in M; ports EN=RX_EN GND=GND LVDS_I_N=Y0_N LVDS_I_P=Y0_P LVDS_O_N=EEM_IO.LVDS_N9 LVDS_O_P=EEM_IO.LVDS_P9 P3V3=P3V3
U_LVDS_repeater14: designators end in O; ports EN=RX_EN GND=GND LVDS_I_N=Y1_N LVDS_I_P=Y1_P LVDS_O_N=EEM_IO.LVDS_N10 LVDS_O_P=EEM_IO.LVDS_P10 P3V3=P3V3
U_LVDS_repeater16: designators end in Q; ports EN=RX_EN GND=GND LVDS_I_N=Y2_N LVDS_I_P=Y2_P LVDS_O_N=EEM_IO.LVDS_N11 LVDS_O_P=EEM_IO.LVDS_P11 P3V3=P3V3
U_LVDS_repeater18: designators end in S; ports EN=RX_EN GND=GND LVDS_I_N=Y3_N LVDS_I_P=Y3_P LVDS_O_N=EEM_IO.LVDS_N12 LVDS_O_P=EEM_IO.LVDS_P12 P3V3=P3V3
U_LVDS_repeater1: designators end in B; ports EN=RX_EN GND=GND LVDS_I_N=SerRX_N LVDS_I_P=SerRX_P LVDS_O_N=EEM_IO.LVDS_N13 LVDS_O_P=EEM_IO.LVDS_P13 P3V3=P3V3
U_LVDS_repeater3: designators end in D; ports EN=TX_EN GND=GND LVDS_I_N=EEM_IO.LVDS_N14 LVDS_I_P=EEM_IO.LVDS_P14 LVDS_O_N=SerTX_N LVDS_O_P=SerTX_P P3V3=P3V3
U_LVDS_repeater5: designators end in F; ports EN=TX_EN GND=GND LVDS_I_N=EEM_IO.LVDS_N5 LVDS_I_P=EEM_IO.LVDS_P5 LVDS_O_N=CC0_N LVDS_O_P=CC0_P P3V3=P3V3
U_LVDS_repeater7: designators end in H; ports EN=TX_EN GND=GND LVDS_I_N=EEM_IO.LVDS_N6 LVDS_I_P=EEM_IO.LVDS_P6 LVDS_O_N=CC1_N LVDS_O_P=CC1_P P3V3=P3V3
U_LVDS_repeater9: designators end in J; ports EN=TX_EN GND=GND LVDS_I_N=EEM_IO.LVDS_N7 LVDS_I_P=EEM_IO.LVDS_P7 LVDS_O_N=CC2_N LVDS_O_P=CC2_P P3V3=P3V3
U_LVDS_repeater11: designators end in L; ports EN=TX_EN GND=GND LVDS_I_N=EEM_IO.LVDS_N15 LVDS_I_P=EEM_IO.LVDS_P15 LVDS_O_N=CC3_N LVDS_O_P=CC3_P P3V3=P3V3
U_LVDS_repeater13: designators end in N; ports EN=RX_EN GND=GND LVDS_I_N=ZCLK_N LVDS_I_P=ZCLK_P LVDS_O_N=EEM_IO.LVDS_N16 LVDS_O_P=EEM_IO.LVDS_P16 P3V3=P3V3
U_LVDS_repeater15: designators end in P; ports EN=RX_EN GND=GND LVDS_I_N=Z0_N LVDS_I_P=Z0_P LVDS_O_N=EEM_IO.LVDS_N17 LVDS_O_P=EEM_IO.LVDS_P17 P3V3=P3V3
U_LVDS_repeater17: designators end in R; ports EN=RX_EN GND=GND LVDS_I_N=Z1_N LVDS_I_P=Z1_P LVDS_O_N=EEM_IO.LVDS_N18 LVDS_O_P=EEM_IO.LVDS_P18 P3V3=P3V3
U_LVDS_repeater19: designators end in T; ports EN=RX_EN GND=GND LVDS_I_N=Z2_N LVDS_I_P=Z2_P LVDS_O_N=EEM_IO.LVDS_N19 LVDS_O_P=EEM_IO.LVDS_P19 P3V3=P3V3
U_LVDS_repeater20: designators end in U; ports EN=RX_EN GND=GND LVDS_I_N=Z3_N LVDS_I_P=Z3_P LVDS_O_N=EEM_IO.LVDS_N20 LVDS_O_P=EEM_IO.LVDS_P20 P3V3=P3V3

### Notes on the sheet
- 2026
- SINARA
- Project:
- Designed by:
- Filename:
- Size:
- Version:
- Last mod. date :
- Sheet:
- A4
- Copyright _______________
  This source describes Open Hardware and is licensed under the CERN-OHL-W v2. You may redistribute and modify this documentation and make products using it under the terms of the CERN-OHL-W v2 (https:/cern.ch/cern-ohl). This documentation is distributed WITHOUT ANY EXPRESS OR IMPLIED WARRANTY, INCLUDING OF MERCHANTABILITY, SATISFACTORY QUALITY AND FITNESS FOR A PARTICULAR PURPOSE. Please see the CERN-OHL-W v2 for applicable conditions.
  As per CERN-OHL-W v2 section 4.1, should You produce hardware based on these sources, You must maintain the Source Location visible on the external case of the product you make using this documentation.
  Source location: =Github
- Last mod. by :
- (in symbol R0402_100R_1%_0.1W_100PPM) 1%

### Library data of the parts
C47 = CC0402_100NF_50V_10%_X7R: Non-polarised capacitor; Part Description: SMD Multilayer Chip Ceramic Capacitor; Manufacturer: GENERIC; Manufacturer1 Part Number: GRM155R71H104KE14D; Voltage: 50V; TC: X7R; Tolerance: ±10%; Part Number: CC0402_100NF_50V_10%_X7R; Component Kind: Standard; Component Type: Standard; Pin Count: 2; Value: 100nF; Status: None; Manufacturer Part Number: CC0402_100NF_50V_10%_X7R; Case: 0402; Mounted: Yes; Socket: No; SMD: Yes; Sense: No; HelpURL: \\cern.ch\dfs\Applications\Altium\Datasheets\CC0402_MURATA_GRM155R71H104KE14D.pdf; Author: CERN DEM MR; CreateDate: 30.06.2017; LatestRevisionDate: 30.06.2017; Manufacturer1 Example: MURATA; Manufacturer1 ComponentHeight: 0.55mm
D1 = NUP4114UPXV6T1G: ESD Protection Diodes Array (8kV) with Low Clamping Voltage; Manufacturer: ON SEMICONDUCTOR; Voltage: 5.5V; PressFit: No; Bonding: No; Part Number: NUP4114UPXV6T1G; Component Kind: Standard; Component Type: Standard; Device: NUP4114UPXV6T1G; PackageDescription: SOTFL (SOT666, SOT563,), 0.50mm, Pitch; 6 Pin, 1.20mm W X 1.60mm L X 0.60mm H Body, IPC Medium Density; Part Description: ESD Protection Diodes Array (8kV) with Low Clamping Voltage; Manufacturer Part Number: NUP4114UPXV6T1G; Pin Count: 8; Mounted: Yes; Socket: No; SMD: Yes; Sense: No; ComponentHeight: 1.75mm; HelpURL: \\cern.ch\dfs\Applications\Altium\Datasheets\NUP4114UPXV6T1G.pdf; Author: CERN DEM JLC; CreateDate: 05.12.2012; LatestRevisionDate: 05.12.2012
IC20 = FIN1101K8X: LVDS Single Port High Speed Repeater; Manufacturer: FAIRCHILD SEMICONDUCTOR; PressFit: No; Bonding: No; Part Number: FIN1101K8X; Component Kind: Standard; Component Type: Standard; Device: FIN1101K8X; PackageDescription: SOP, 0.50mm Pitch; 8 pin, 2.30mm W X 2.00mm L X 0.90mm H body, PC Medium Density; Part Description: LVDS Single Port High Speed Repeater; Manufacturer Part Number: FIN1101K8X; Pin Count: 8; Case: TSSOP8; Mounted: Yes; Socket: No; SMD: Yes; Sense: No; ComponentHeight: 0.8mm; Author: CERN DEM JLC; HelpURL: \\cern.ch\dfs\Applications\Altium\Datasheets\FIN1101K8X.pdf; CreateDate: 08.11.2016; LatestRevisionDate: 08.11.2016
R131 = R0402_100R_1%_0.1W_100PPM: Resistor - 1%; Part Description: General Purpose Thick Film Chip Resistor; Manufacturer: GENERIC; Manufacturer Part Number: R0402_100R_1%_0.1W_100PPM_50V; Manufacturer1 Part Number: ERJ2RKF1000X; Power: 0.1W; TC: ±100ppm/°C; Voltage: 50V; Part Number: R0402_100R_1%_0.1W_100PPM; Component Kind: Standard; Component Type: Standard; Pin Count: 2; Value: 100; Status: Not recommended; Tolerance: ±1%; Case: 0402; Mounted: Yes; Sense: No; Socket: No; SMD: Yes; Manufacturer1 Example: PANASONIC; Manufacturer1 ComponentHeight: 0.4mm; HelpURL: \\cern.ch\dfs\Applications\Altium\Datasheets\R0402_PANASONIC_ERJ2RK.pdf; Author: CERN DEM JLC; CreateDate: 12.12.2013; LatestRevisionDate: 03.03.2015

## Nets that join several sheets
GND: Power_Supplies (24 pins), CPCIS_Connectors_P1_P6 (55 pins), DIOT_signal_routing (T_C22.1 T_C23.1 T_IC8.4), EEM_Connectors (52 pins), Temperature_monitoring (5 pins), Mechanical (T_C12.2 T_R26.2 T_R27.2), FP_Connectors (12 pins), U_LVDS_repeater0 (C47A.1 D1A.2 IC20A.2 IC20A.4), U_LVDS_repeater2 (C47C.1 D1C.2 IC20C.2 IC20C.4), U_LVDS_repeater4 (C47E.1 D1E.2 IC20E.2 IC20E.4), U_LVDS_repeater6 (C47G.1 D1G.2 IC20G.2 IC20G.4), U_LVDS_repeater8 (C47I.1 D1I.2 IC20I.2 IC20I.4), U_LVDS_repeater10 (C47K.1 D1K.2 IC20K.2 IC20K.4), U_LVDS_repeater12 (C47M.1 D1M.2 IC20M.2 IC20M.4), U_LVDS_repeater14 (C47O.1 D1O.2 IC20O.2 IC20O.4), U_LVDS_repeater16 (C47Q.1 D1Q.2 IC20Q.2 IC20Q.4), U_LVDS_repeater18 (C47S.1 D1S.2 IC20S.2 IC20S.4), U_LVDS_repeater1 (C47B.1 D1B.2 IC20B.2 IC20B.4), U_LVDS_repeater3 (C47D.1 D1D.2 IC20D.2 IC20D.4), U_LVDS_repeater5 (C47F.1 D1F.2 IC20F.2 IC20F.4), U_LVDS_repeater7 (C47H.1 D1H.2 IC20H.2 IC20H.4), U_LVDS_repeater9 (C47J.1 D1J.2 IC20J.2 IC20J.4), U_LVDS_repeater11 (C47L.1 D1L.2 IC20L.2 IC20L.4), U_LVDS_repeater13 (C47N.1 D1N.2 IC20N.2 IC20N.4), U_LVDS_repeater15 (C47P.1 D1P.2 IC20P.2 IC20P.4), U_LVDS_repeater17 (C47R.1 D1R.2 IC20R.2 IC20R.4), U_LVDS_repeater19 (C47T.1 D1T.2 IC20T.2 IC20T.4), U_LVDS_repeater20 (C47U.1 D1U.2 IC20U.2 IC20U.4)
P3V3: Grabber_DIOT (R8.1 R9.1), Power_Supplies (11 pins), U_LVDS_repeater0 (C47A.2 D1A.5 IC20A.7), U_LVDS_repeater2 (C47C.2 D1C.5 IC20C.7), U_LVDS_repeater4 (C47E.2 D1E.5 IC20E.7), U_LVDS_repeater6 (C47G.2 D1G.5 IC20G.7), U_LVDS_repeater8 (C47I.2 D1I.5 IC20I.7), U_LVDS_repeater10 (C47K.2 D1K.5 IC20K.7), U_LVDS_repeater12 (C47M.2 D1M.5 IC20M.7), U_LVDS_repeater14 (C47O.2 D1O.5 IC20O.7), U_LVDS_repeater16 (C47Q.2 D1Q.5 IC20Q.7), U_LVDS_repeater18 (C47S.2 D1S.5 IC20S.7), U_LVDS_repeater1 (C47B.2 D1B.5 IC20B.7), U_LVDS_repeater3 (C47D.2 D1D.5 IC20D.7), U_LVDS_repeater5 (C47F.2 D1F.5 IC20F.7), U_LVDS_repeater7 (C47H.2 D1H.5 IC20H.7), U_LVDS_repeater9 (C47J.2 D1J.5 IC20J.7), U_LVDS_repeater11 (C47L.2 D1L.5 IC20L.7), U_LVDS_repeater13 (C47N.2 D1N.5 IC20N.7), U_LVDS_repeater15 (C47P.2 D1P.5 IC20P.7), U_LVDS_repeater17 (C47R.2 D1R.5 IC20R.7), U_LVDS_repeater19 (C47T.2 D1T.5 IC20T.7), U_LVDS_repeater20 (C47U.2 D1U.5 IC20U.7)
P3V3_MP: Power_Supplies (5 pins), DIOT_signal_routing (T_C22.2 T_C23.2 T_IC8.1 T_IC8.8), EEM_Connectors (5 pins), Temperature_monitoring (T_C8.2 T_IC6.8)
P3V3_MP2: Power_Supplies (T_R9.2 T_TP4.1), EEM_Connectors (5 pins)
P3V3_MP3: Power_Supplies (T_R10.2 T_TP5.1), EEM_Connectors (5 pins)
P12V0: Power_Supplies (8 pins), CPCIS_Connectors_P1_P6 (7 pins), EEM_Connectors (6 pins)
BP_I2C.SCL: CPCIS_Connectors_P1_P6 (T_D2.3 T_J4.B2), DIOT_signal_routing (T_IC8.6)
BP_I2C.SDA: CPCIS_Connectors_P1_P6 (T_D2.1 T_J4.C2), DIOT_signal_routing (T_IC8.7)
BP_IO.LVDS_N0: CPCIS_Connectors_P1_P6 (T_J4.E3), DIOT_signal_routing (T_R51.1)
BP_IO.LVDS_N1: CPCIS_Connectors_P1_P6 (T_J4.B3), DIOT_signal_routing (T_R52.1)
BP_IO.LVDS_N2: CPCIS_Connectors_P1_P6 (T_J4.C4), DIOT_signal_routing (T_R53.1)
BP_IO.LVDS_N3: CPCIS_Connectors_P1_P6 (T_J4.L4), DIOT_signal_routing (T_R54.1)
BP_IO.LVDS_N4: CPCIS_Connectors_P1_P6 (T_J4.I4), DIOT_signal_routing (T_R55.1)
BP_IO.LVDS_N5: CPCIS_Connectors_P1_P6 (T_J4.K5), DIOT_signal_routing (T_R56.1)
BP_IO.LVDS_N6: CPCIS_Connectors_P1_P6 (T_J4.H5), DIOT_signal_routing (T_R57.1)
BP_IO.LVDS_N7: CPCIS_Connectors_P1_P6 (T_J4.F6), DIOT_signal_routing (T_R58.1)
BP_IO.LVDS_N8: CPCIS_Connectors_P1_P6 (T_J4.C6), DIOT_signal_routing (T_R59.1)
BP_IO.LVDS_N9: CPCIS_Connectors_P1_P6 (T_J4.L6), DIOT_signal_routing (T_R60.1)
BP_IO.LVDS_N10: CPCIS_Connectors_P1_P6 (T_J4.I6), DIOT_signal_routing (T_R61.1)
BP_IO.LVDS_N11: CPCIS_Connectors_P1_P6 (T_J5.E1), DIOT_signal_routing (T_R62.1)
BP_IO.LVDS_N12: CPCIS_Connectors_P1_P6 (T_J5.B1), DIOT_signal_routing (T_R63.1)
BP_IO.LVDS_N13: CPCIS_Connectors_P1_P6 (T_J5.K1), DIOT_signal_routing (T_R64.1)
BP_IO.LVDS_N14: CPCIS_Connectors_P1_P6 (T_J5.H1), DIOT_signal_routing (T_R65.1)
BP_IO.LVDS_N15: CPCIS_Connectors_P1_P6 (T_J4.F2), DIOT_signal_routing (T_R66.2)
BP_IO.LVDS_P0: CPCIS_Connectors_P1_P6 (T_J4.D3), DIOT_signal_routing (T_R35.1)
BP_IO.LVDS_P1: CPCIS_Connectors_P1_P6 (T_J4.A3), DIOT_signal_routing (T_R36.1)
BP_IO.LVDS_P2: CPCIS_Connectors_P1_P6 (T_J4.B4), DIOT_signal_routing (T_R37.1)
BP_IO.LVDS_P3: CPCIS_Connectors_P1_P6 (T_J4.K4), DIOT_signal_routing (T_R38.1)
BP_IO.LVDS_P4: CPCIS_Connectors_P1_P6 (T_J4.H4), DIOT_signal_routing (T_R39.1)
BP_IO.LVDS_P5: CPCIS_Connectors_P1_P6 (T_J4.J5), DIOT_signal_routing (T_R40.1)
BP_IO.LVDS_P6: CPCIS_Connectors_P1_P6 (T_J4.G5), DIOT_signal_routing (T_R41.1)
BP_IO.LVDS_P7: CPCIS_Connectors_P1_P6 (T_J4.E6), DIOT_signal_routing (T_R42.1)
BP_IO.LVDS_P8: CPCIS_Connectors_P1_P6 (T_J4.B6), DIOT_signal_routing (T_R43.1)
BP_IO.LVDS_P9: CPCIS_Connectors_P1_P6 (T_J4.K6), DIOT_signal_routing (T_R44.1)
BP_IO.LVDS_P10: CPCIS_Connectors_P1_P6 (T_J4.H6), DIOT_signal_routing (T_R45.1)
BP_IO.LVDS_P11: CPCIS_Connectors_P1_P6 (T_J5.D1), DIOT_signal_routing (T_R46.1)
BP_IO.LVDS_P12: CPCIS_Connectors_P1_P6 (T_J5.A1), DIOT_signal_routing (T_R47.1)
BP_IO.LVDS_P13: CPCIS_Connectors_P1_P6 (T_J5.J1), DIOT_signal_routing (T_R48.1)
BP_IO.LVDS_P14: CPCIS_Connectors_P1_P6 (T_J5.G1), DIOT_signal_routing (T_R49.1)
BP_IO.LVDS_P15: CPCIS_Connectors_P1_P6 (T_J4.E2), DIOT_signal_routing (T_R50.2)
CC0_N: FP_Connectors (J1.18), U_LVDS_repeater5 (D1F.6 IC20F.5)
CC0_P: FP_Connectors (J1.5), U_LVDS_repeater5 (D1F.1 IC20F.6)
CC1_N: FP_Connectors (J1.4), U_LVDS_repeater7 (D1H.6 IC20H.5)
CC1_P: FP_Connectors (J1.17), U_LVDS_repeater7 (D1H.1 IC20H.6)
CC2_N: FP_Connectors (J1.16), U_LVDS_repeater9 (D1J.6 IC20J.5)
CC2_P: FP_Connectors (J1.3), U_LVDS_repeater9 (D1J.1 IC20J.6)
CC3_N: FP_Connectors (J1.2), U_LVDS_repeater11 (D1L.6 IC20L.5)
CC3_P: FP_Connectors (J1.15), U_LVDS_repeater11 (D1L.1 IC20L.6)
EEM0_I2C.SCL: DIOT_signal_routing (T_IC8.3), EEM_Connectors (T_D1.3 T_IC2.1 T_IC3.6 T_J1.27), Temperature_monitoring (T_IC6.2)
EEM0_I2C.SDA: DIOT_signal_routing (T_IC8.2), EEM_Connectors (T_D1.1 T_IC2.3 T_IC3.5 T_J1.26), Temperature_monitoring (T_IC6.1)
EEM_IO.LVDS_N0: DIOT_signal_routing (T_R51.2), EEM_Connectors (T_J1.3)
EEM_IO.LVDS_N1: DIOT_signal_routing (T_R52.2), EEM_Connectors (T_J1.6)
EEM_IO.LVDS_N2: DIOT_signal_routing (T_R53.2), EEM_Connectors (T_J1.9)
EEM_IO.LVDS_N3: DIOT_signal_routing (T_R54.2), EEM_Connectors (T_J1.12)
EEM_IO.LVDS_N4: DIOT_signal_routing (T_R55.2), EEM_Connectors (T_J1.15)
EEM_IO.LVDS_N5: DIOT_signal_routing (T_R56.2), EEM_Connectors (T_J1.18)
EEM_IO.LVDS_N6: DIOT_signal_routing (T_R57.2), EEM_Connectors (T_J1.21)
EEM_IO.LVDS_N7: DIOT_signal_routing (T_R58.2), EEM_Connectors (T_J1.24)
EEM_IO.LVDS_N8: DIOT_signal_routing (T_R59.2), EEM_Connectors (T_J2.3)
EEM_IO.LVDS_N9: DIOT_signal_routing (T_R60.2), EEM_Connectors (T_J2.6)
EEM_IO.LVDS_N10: DIOT_signal_routing (T_R61.2), EEM_Connectors (T_J2.9)
EEM_IO.LVDS_N11: DIOT_signal_routing (T_R62.2), EEM_Connectors (T_J2.12)
EEM_IO.LVDS_N12: DIOT_signal_routing (T_R63.2), EEM_Connectors (T_J2.15)
EEM_IO.LVDS_N13: DIOT_signal_routing (T_R64.2), EEM_Connectors (T_J2.18)
EEM_IO.LVDS_N14: DIOT_signal_routing (T_R65.2), EEM_Connectors (T_J2.21)
EEM_IO.LVDS_N15: DIOT_signal_routing (T_R66.1), EEM_Connectors (T_J2.24)
EEM_IO.LVDS_P0: DIOT_signal_routing (T_R35.2), EEM_Connectors (T_J1.2)
EEM_IO.LVDS_P1: DIOT_signal_routing (T_R36.2), EEM_Connectors (T_J1.5)
EEM_IO.LVDS_P2: DIOT_signal_routing (T_R37.2), EEM_Connectors (T_J1.8)
EEM_IO.LVDS_P3: DIOT_signal_routing (T_R38.2), EEM_Connectors (T_J1.11)
EEM_IO.LVDS_P4: DIOT_signal_routing (T_R39.2), EEM_Connectors (T_J1.14)
EEM_IO.LVDS_P5: DIOT_signal_routing (T_R40.2), EEM_Connectors (T_J1.17)
EEM_IO.LVDS_P6: DIOT_signal_routing (T_R41.2), EEM_Connectors (T_J1.20)
EEM_IO.LVDS_P7: DIOT_signal_routing (T_R42.2), EEM_Connectors (T_J1.23)
EEM_IO.LVDS_P8: DIOT_signal_routing (T_R43.2), EEM_Connectors (T_J2.2)
EEM_IO.LVDS_P9: DIOT_signal_routing (T_R44.2), EEM_Connectors (T_J2.5)
EEM_IO.LVDS_P10: DIOT_signal_routing (T_R45.2), EEM_Connectors (T_J2.8)
EEM_IO.LVDS_P11: DIOT_signal_routing (T_R46.2), EEM_Connectors (T_J2.11)
EEM_IO.LVDS_P12: DIOT_signal_routing (T_R47.2), EEM_Connectors (T_J2.14)
EEM_IO.LVDS_P13: DIOT_signal_routing (T_R48.2), EEM_Connectors (T_J2.17)
EEM_IO.LVDS_P14: DIOT_signal_routing (T_R49.2), EEM_Connectors (T_J2.20)
EEM_IO.LVDS_P15: DIOT_signal_routing (T_R50.1), EEM_Connectors (T_J2.23)
PSU_EN: Power_Supplies (IC27.3 T_LD1.3 T_R8.1), Temperature_monitoring (T_IC6.3)
RX_EN: Grabber_DIOT (R8.2), U_LVDS_repeater0 (IC20A.3), U_LVDS_repeater2 (IC20C.3), U_LVDS_repeater4 (IC20E.3), U_LVDS_repeater6 (IC20G.3), U_LVDS_repeater8 (IC20I.3), U_LVDS_repeater10 (IC20K.3), U_LVDS_repeater12 (IC20M.3), U_LVDS_repeater14 (IC20O.3), U_LVDS_repeater16 (IC20Q.3), U_LVDS_repeater18 (IC20S.3), U_LVDS_repeater1 (IC20B.3), U_LVDS_repeater13 (IC20N.3), U_LVDS_repeater15 (IC20P.3), U_LVDS_repeater17 (IC20R.3), U_LVDS_repeater19 (IC20T.3), U_LVDS_repeater20 (IC20U.3)
SerRX_N: FP_Connectors (J1.19), U_LVDS_repeater1 (D1B.3 IC20B.1 R131B.1)
SerRX_P: FP_Connectors (J1.6), U_LVDS_repeater1 (D1B.4 IC20B.8 R131B.2)
SerTX_N: FP_Connectors (J1.7), U_LVDS_repeater3 (D1D.6 IC20D.5)
SerTX_P: FP_Connectors (J1.20), U_LVDS_repeater3 (D1D.1 IC20D.6)
SERVMOD_3V3: CPCIS_Connectors_P1_P6 (T_R17.1 T_R19.2), DIOT_signal_routing (T_IC8.5)
TX_EN: Grabber_DIOT (R9.2), U_LVDS_repeater3 (IC20D.3), U_LVDS_repeater5 (IC20F.3), U_LVDS_repeater7 (IC20H.3), U_LVDS_repeater9 (IC20J.3), U_LVDS_repeater11 (IC20L.3)
X0_N: FP_Connectors (J1.25), U_LVDS_repeater2 (D1C.3 IC20C.1 R131C.1)
X0_P: FP_Connectors (J1.12), U_LVDS_repeater2 (D1C.4 IC20C.8 R131C.2)
X1_N: FP_Connectors (J1.24), U_LVDS_repeater4 (D1E.3 IC20E.1 R131E.1)
X1_P: FP_Connectors (J1.11), U_LVDS_repeater4 (D1E.4 IC20E.8 R131E.2)
X2_N: FP_Connectors (J1.23), U_LVDS_repeater6 (D1G.3 IC20G.1 R131G.1)
X2_P: FP_Connectors (J1.10), U_LVDS_repeater6 (D1G.4 IC20G.8 R131G.2)
X3_N: FP_Connectors (J1.21), U_LVDS_repeater8 (D1I.3 IC20I.1 R131I.1)
X3_P: FP_Connectors (J1.8), U_LVDS_repeater8 (D1I.4 IC20I.8 R131I.2)
XCLK_N: FP_Connectors (J1.22), U_LVDS_repeater0 (D1A.3 IC20A.1 R131A.1)
XCLK_P: FP_Connectors (J1.9), U_LVDS_repeater0 (D1A.4 IC20A.8 R131A.2)
Y0_N: FP_Connectors (J2.25), U_LVDS_repeater12 (D1M.3 IC20M.1 R131M.1)
Y0_P: FP_Connectors (J2.12), U_LVDS_repeater12 (D1M.4 IC20M.8 R131M.2)
Y1_N: FP_Connectors (J2.24), U_LVDS_repeater14 (D1O.3 IC20O.1 R131O.1)
Y1_P: FP_Connectors (J2.11), U_LVDS_repeater14 (D1O.4 IC20O.8 R131O.2)
Y2_N: FP_Connectors (J2.23), U_LVDS_repeater16 (D1Q.3 IC20Q.1 R131Q.1)
Y2_P: FP_Connectors (J2.10), U_LVDS_repeater16 (D1Q.4 IC20Q.8 R131Q.2)
Y3_N: FP_Connectors (J2.21), U_LVDS_repeater18 (D1S.3 IC20S.1 R131S.1)
Y3_P: FP_Connectors (J2.8), U_LVDS_repeater18 (D1S.4 IC20S.8 R131S.2)
YCLK_N: FP_Connectors (J2.22), U_LVDS_repeater10 (D1K.3 IC20K.1 R131K.1)
YCLK_P: FP_Connectors (J2.9), U_LVDS_repeater10 (D1K.4 IC20K.8 R131K.2)
Z0_N: FP_Connectors (J2.19), U_LVDS_repeater15 (D1P.3 IC20P.1 R131P.1)
Z0_P: FP_Connectors (J2.6), U_LVDS_repeater15 (D1P.4 IC20P.8 R131P.2)
Z1_N: FP_Connectors (J2.18), U_LVDS_repeater17 (D1R.3 IC20R.1 R131R.1)
Z1_P: FP_Connectors (J2.5), U_LVDS_repeater17 (D1R.4 IC20R.8 R131R.2)
Z2_N: FP_Connectors (J2.17), U_LVDS_repeater19 (D1T.3 IC20T.1 R131T.1)
Z2_P: FP_Connectors (J2.4), U_LVDS_repeater19 (D1T.4 IC20T.8 R131T.2)
Z3_N: FP_Connectors (J2.15), U_LVDS_repeater20 (D1U.3 IC20U.1 R131U.1)
Z3_P: FP_Connectors (J2.2), U_LVDS_repeater20 (D1U.4 IC20U.8 R131U.2)
ZCLK_N: FP_Connectors (J2.16), U_LVDS_repeater13 (D1N.3 IC20N.1 R131N.1)
ZCLK_P: FP_Connectors (J2.3), U_LVDS_repeater13 (D1N.4 IC20N.8 R131N.2)

## Assembly variants
EEM: not fitted T_IC3 T_IC5 T_IC10 T_J4 T_J5 T_R2 T_R4 T_R35 T_R36 T_R37 T_R38 T_R39 T_R40 T_R41 T_R42 T_R43 T_R44 T_R45 T_R46 T_R47 T_R48 T_R49 T_R50 T_R51 T_R52 T_R53 T_R54 T_R55 T_R56 T_R57 T_R58 T_R59 T_R60 T_R61 T_R62 T_R63 T_R64 T_R65 T_R66; alternate parts T_R26 -> R0805_0R_JUMPER
DIOT: not fitted T_IC3 T_IC5 T_IC10